# Altium schematic sheet Current Sensing.SchDoc
size A4; SheetNumber: 4; SheetTotal: 4
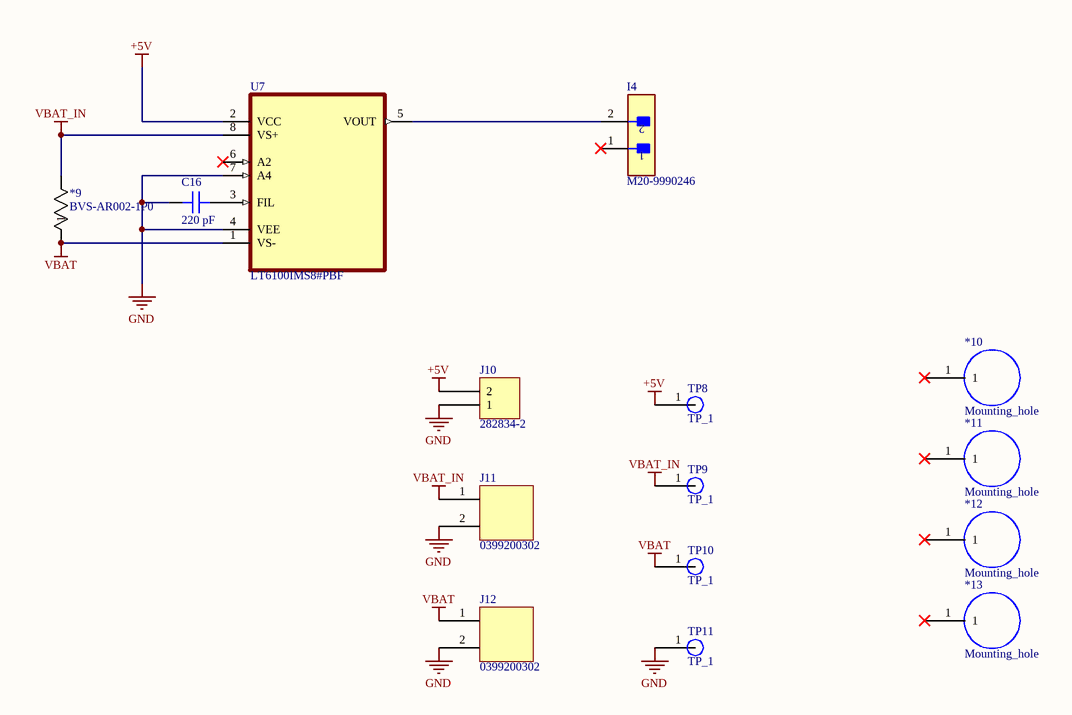
[diagram p0: Current Sensing.SchDoc]

## Parts
*9  BVS-AR002-1P0  [BVS-R002-1P0]
*10  Mounting_hole  [Mounting_Hole]
*11  Mounting_hole  [Mounting_Hole]
*12  Mounting_hole  [Mounting_Hole]
*13  Mounting_hole  [Mounting_Hole]
C16  220 pF  [CAP 0402_1005]
I4  M20-9990246  [FP-M20-9990246-MFG]
J10  282834-2  [TE 282834-2]
J11  0399200302  [0399200302]  (no BOM)
J12  0399200302  [0399200302]  (no BOM)
TP8  TP_1  [Test_point1]  (no BOM)
TP9  TP_1  [Test_point1]  (no BOM)
TP10  TP_1  [Test_point1]  (no BOM)
TP11  TP_1  [Test_point1]  (no BOM)
U7  LT6100IMS8#PBF  [SOP65P490X110-8N]

## Nets
+5V: J10.2 TP8.1 U7.2(VCC)
GND: C16.1 J10.1 J11.2 J12.2 TP11.1 U7.4(VEE) U7.7(A4)
VBAT: *9.1 J12.1 TP10.1 U7.1(VS-)
VBAT_IN: *9.2 J11.1 TP9.1 U7.8(VS+)
NetC16_2: C16.2 U7.3(FIL)
NetI4_2: I4.2 U7.5(VOUT)

Not connected (* = marked no-connect by the designer): *10 1*; *11 1*; *12 1*; *13 1*; I4 1*; U7 6(A2)*

## Library data of the parts
C16 = UMK105CH221JVHF: CAP CER 220PF 50V CH 0402; manufacturer: Taiyo Yuden; Tolerance: ±5%; Part Number: UMK105CH221JVHF; Value: 220 pF; Applications: Automotive; Capacitance: 220 pF; componentlink2description: DigiKey Link; componentlink2url: https://www.digikey.com/en/products/detail/taiyo-yuden/UMK105CH221JVHF/6563668; Device Package: 0402 (1005 Metric); lastupdated: 2024-01-28 8:04:19 PM; Lifecycle Status: Active; Minimum Order: 1; Mounting Type: Surface Mount, MLCC; Package / Case: 0402 (1005 Metric); packaging: TapeAndReel; partid: 1938; Part Status: Active; price: 0.01; Ratings: AEC-Q200; series: M; Size / Dimension: 0.039" L x 0.020" W (1.00mm x 0.50mm); Supplier 1: DigiKey; Supplier Part Number 1: 587-5075-1-ND; Temperature Coefficient: CH; Voltage - Rated: 50V
I4 = CMP-15831-000009-1: CONN HEADER VERT 2POS 2.54MM; Manufacturer: Harwin; Conn Gender: Male; Conn Orientation: Vertical; Number Of Contacts: 2; Current Rating: 3A; ComponentLink2URL: https://cdn.harwin.com/pdfs/M20-999.pdf; ComponentLink2Description: Datasheet; Package: M20-9990246; Temperature: -40°C to +105°C; Octopart: https://octopart.com/m20-9990246-harwin-2590635; Mouser Description: 2.54mm (0.1") Pitch SIL Vertical PC Tail Pin Header, 6.1mm mating pin height, tin, 2 contacts; Temperature Range High: +105°C; Device Class L1: Connectors; RoHS: TRUE; Automotive: No; Height: 8.99mm; Number Of Rows: 1; Contact Material: Tin,Nickel; Category: Conn; Pitch: 2.54mm; Lead Free: Yes; Digikey Description: CONN HEADER VERT 2POS 2.54MM; Manufacturer Part Number: M20-9990246; Temperature Range Low: -40°C; Device Class L3: unset; Device Class L2: Headers and Wire Housings
J10 = 282834-2: TERM BLK 2P SIDE ENT 2.54MM PCB; Manufacturer: TE Connectivity AMP Connectors; Current: 10A; Mating Orientation: Horizontal with Board; Number of Levels: 1; Pitch: 0.100" (2.54mm); Positions Per Level: 2; Voltage: 150V; Wire Gauge: 16-30 AWG; Wire Termination: Screw - Rising Cage Clamp; Part Number: 282834-2; Color: Green; ComponentLink1Description: Datasheet; ComponentLink1URL: https://www.te.com/commerce/DocumentDelivery/DDEController?Action=srchrtrv&DocNm=282834&DocType=Customer+Drawing&DocLang=English; ComponentLink2Description: DigiKey Link; ComponentLink2URL: http://digikey.com/product-detail/en/te-connectivity-amp-connectors/282834-2/A98333-ND/1150135; LastUpdated: 2020-01-15 4:15:38 AM; Lifecycle Status: Active; Minimum Order: 1; Mounting Type: Through Hole; Packaging: Bulk; Part Status: Active; Price: 0.88; Series: Buchanan; Supplier 1: DigiKey; Supplier Part Number 1: A98333-ND
TP8-TP11 = Test_point1
U7 = CMP-353-000000-2: Precision, Gain Selectable High Side Current Sense Amplifier; MF: Analog Devices; Design Item ID: LT6100IMS8#PBF; Component Type: Standard; Value: *; Check_prices: https://www.snapeda.com/parts/LT6100IMS8%23PBF/Analog+Devices/view-part/?ref=eda; SnapEDA_Link: https://www.snapeda.com/parts/LT6100IMS8%23PBF/Analog+Devices/view-part/?ref=snap; Pin Count: 8; Package: MSOP-8 Analog Devices; MP: LT6100IMS8#PBF; Source: LT6100IMS8#PBF.SchLib